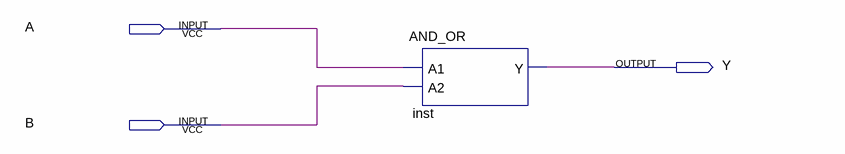
[diagram p0: schematic sheet]
// Quartus schematic top_level.bdf as structural Verilog: 1 symbols, 3 pins
module top_level (
  input  A,
  input  B,
  output Y
);

  AND_OR inst (.A1(A), .A2(B), .Y(Y));
endmodule
